# Altium schematic sheet CP2102.SchDoc
size A; SheetNumber: 5; SheetTotal: 7
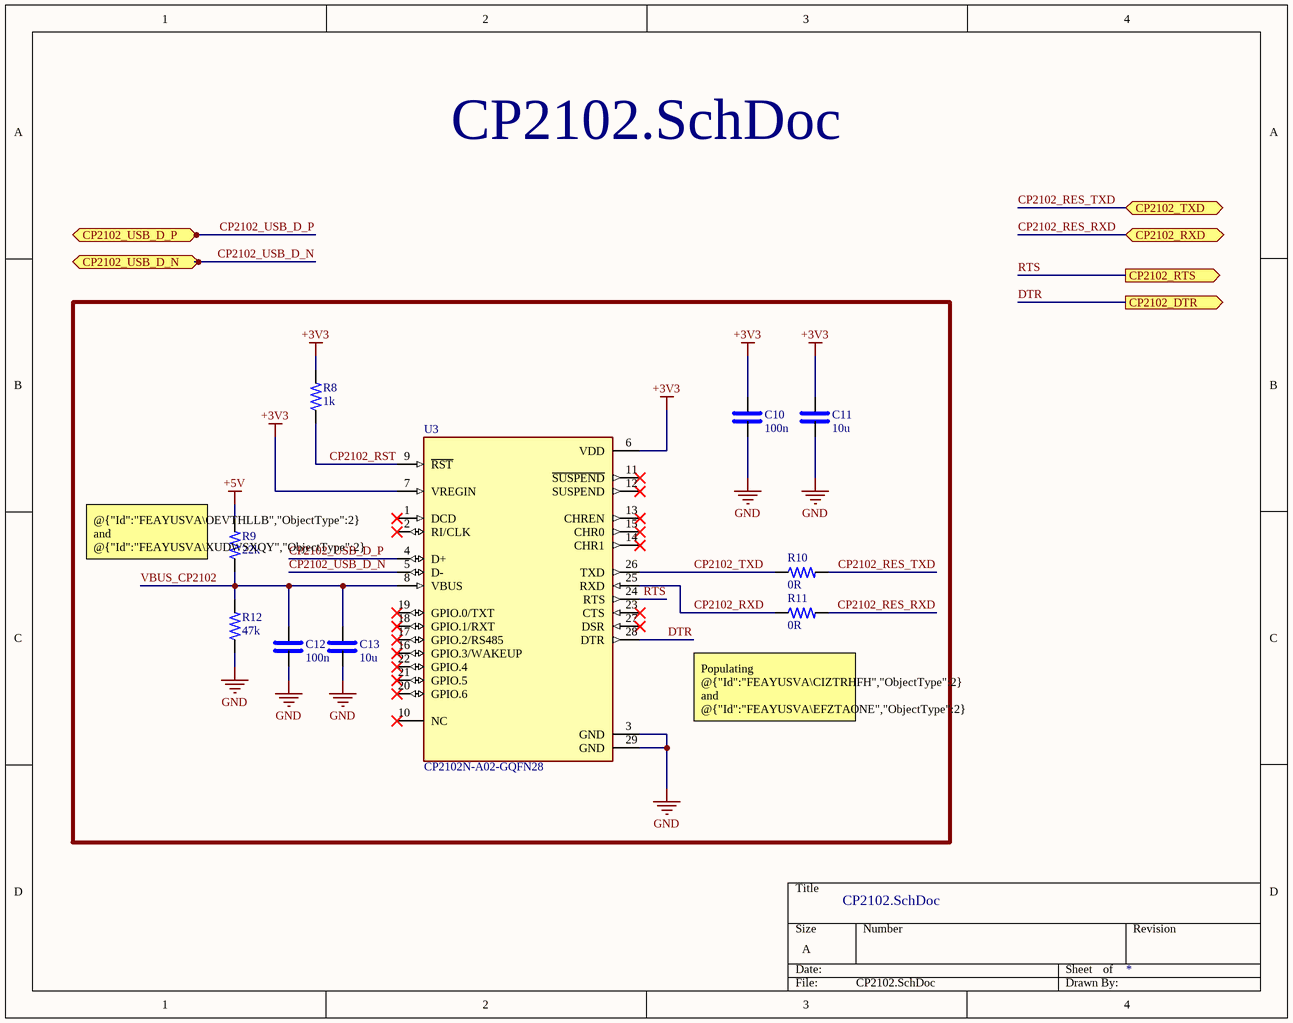
[diagram p0: CP2102.SchDoc]

## Parts
C10  100n  [0402 CAP]
C11  10u  [FP-GCJ188-0_2-IPC_C]
C12  100n  [0402 CAP]
C13  10u  [FP-GCJ188-0_2-IPC_C]
R8  1k  [0402 RES]
R9  22k  [0402 RES]
R10  0R  [0402 RES]
R11  0R  [0402 RES]
R12  47k  [0402 RES]
U3  CP2102N-A02-GQFN28  [QFN50P500X500X80-29N]

## Ports
CP2102_DTR (out, see Master[2C]), CP2102_RTS (out, see Master[2C]), CP2102_RXD (bidir, see Master[2C]), CP2102_TXD (bidir, see Master[2C]), CP2102_USB_D_N (bidir, see Master[3C]), CP2102_USB_D_P (bidir, see Master[3C])

## Nets
+3V3: C10.2 C11.2 R8.2 U3.6(VDD) U3.7(VREGIN)
+5V: R9.2
GND: C10.1 C11.1 C12.1 C13.1 R12.1 U3.3(GND) U3.29(GND)
CP2102_RES_RXD: R11.2 ; port CP2102_RXD
CP2102_RES_TXD: R10.2 ; port CP2102_TXD
CP2102_RST: R8.1 U3.9(~{RST})
CP2102_RXD: R11.1 U3.25(RXD)
CP2102_TXD: R10.1 U3.26(TXD)
CP2102_USB_D_N: U3.5(D-) ; port CP2102_USB_D_N
CP2102_USB_D_P: U3.4(D+) ; port CP2102_USB_D_P
DTR: U3.28(DTR) ; port CP2102_DTR
RTS: U3.24(RTS) ; port CP2102_RTS
VBUS_CP2102: C12.2 C13.2 R9.1 R12.2 U3.8(VBUS)

Not connected (* = marked no-connect by the designer): U3 1(DCD)* 2(RI/CLK)* 10(NC)* 11(~{SUSPEND})* 12(SUSPEND)* 13(CHREN)* 14(CHR1)* 15(CHR0)* 16(GPIO.3/WAKEUP)* 17(GPIO.2/RS485)* 18(GPIO.1/RXT)* 19(GPIO.0/TXT)* 20(GPIO.6)* 21(GPIO.5)* 22(GPIO.4)* 23(CTS)* 27(DSR)*

## Notes on the sheet
- (near R9) @{"Id":"FEAYUSVA\OEVTHLLB","ObjectType":2} and @{"Id":"FEAYUSVA\XUDWSXQY","ObjectType":2} are used to drop out the voltage to 3.3V
- (near R11) Populating @{"Id":"FEAYUSVA\CIZTRHFH","ObjectType":2} and @{"Id":"FEAYUSVA\EFZTAONE","ObjectType":2} is a must to program the ESP32 via UART.

## Library data of the parts
C10 C12 = 0402 SMD Capacitor: Multilayer Ceramic Capacitor, 0.1 uF, 25 V, ï¿½ 10%, X7R, 0402 [1005 Metric]; Manufacturer: Samsung; Manufacturer Part Number: CL05B104KA5NNNC; Material: 4241ConductorMaterial; Value: 100nF; Voltage Rating: 25V; ComponentLink1Description: Link; ComponentLink1URL: *; Supplier: Digikey; Supplier Part Number: 1276-6720-1-ND; RoHS: Yes; Category: Ceramic Capacitors; Stock: 9938397; Pricing: 1=0.08, 10=0.006, 50=0.0056, 100=0.0048, 500=0.0044, 1000=0.004, 2500=0.0032 (USD); Mounting Technology: Surface Mount; Case/Package: 0402; Case Code (Metric): 1005; Case Code (Imperial): 0402; Min Operating Temperature: -55°C; Max Operating Temperature: 125°C; Packaging: Cut Tape; Tolerance: 10%; Series: CL; Voltage Rating (DC): 25V; Length: 0.039inch; Width: 0.02inch; Height: 550um; Thickness: 0.022inch; RoHS Compliant: Yes; ComponentLink2URL: https://datasheet.octopart.com/CL05B104KA5NNNC-Samsung-Electro-Mechanics-datasheet-116890910.pdf?src-supplier=Future+Electronics; ComponentLink2Description: https://datasheet.octopart.com/CL05B104KA5NNNC-Samsung-Electro-Mechanics-datasheet-116890910.pdf?src-supplier=Future+Electronics; ComponentLink3URL: http://www.samsungsem.com/kr/support/product-search/mlcc/CL05B104KA5NNNC.jsp?src-supplier=Digikey; ComponentLink3Description: http://www.samsungsem.com/kr/support/product-search/mlcc/CL05B104KA5NNNC.jsp?src-supplier=Digikey
C11 C13 = 0603 SMD CAP: Multilayer Ceramic Capacitor, 10 uF, 25 V, ï¿½ 10%, X5R, 0603 [1608 Metric]; Manufacturer: Murata; Manufacturer Part Number: GRM188R61E106KA73D; Material: 4241ConductorMaterial; Dielectric: 1537DielectricType; Voltage Rating (DC): 25V; Supplier: Mouser; Supplier Part Number: 81-GRM188R61E106KA3D; RoHS: Yes; Category: Ceramic Capacitors; Stock: 343973; Pricing: 1=0.22, 10=0.073, 50=0.073, 100=0.054, 1000=0.05, 10000=0.038 (USD); Length: 1.6mm; Width: 800um; Height: 1mm; Thickness: 800um; ComponentLink1URL: https://datasheet.octopart.com/GRM188R61E106KA73D-Murata-datasheet-149523249.pdf?src-supplier=Newark; ComponentLink1Description: https://datasheet.octopart.com/GRM188R61E106KA73D-Murata-datasheet-149523249.pdf?src-supplier=Newark; ComponentLink2URL: https://search.murata.co.jp/Ceramy/image/img/A01X/G101/ENG/GRM188R61E106KA73-01.pdf?src-supplier=Digikey; ComponentLink2Description: https://search.murata.co.jp/Ceramy/image/img/A01X/G101/ENG/GRM188R61E106KA73-01.pdf?src-supplier=Digikey; ComponentLink3URL: https://datasheet.octopart.com/GRM188R61E106KA73D-Murata-datasheet-165579666.pdf?src-supplier=TME; ComponentLink3Description: https://datasheet.octopart.com/GRM188R61E106KA73D-Murata-datasheet-165579666.pdf?src-supplier=TME
R8 = 0402 SMD Resistor: Res Thick Film 0402 1K Ohm 1% 0.125W(1/8W) ±200ppm/C Pad SMD T/R; Manufacturer: Yageo; Manufacturer Part Number: RC0402FR-7W1KL; Value: 1kR; ComponentLink1Description: Link; ComponentLink1URL: *; Supplier: Digikey; Supplier Part Number: 13-RC0402FR-7W1KLCT-ND; RoHS: Yes; Category: Chip SMD Resistors; Stock: 22503; Pricing: 1=0.1, 10=0.013, 50=0.0108, 100=0.0082, 500=0.00714, 1000=0.00612, 5000=0.0051 (USD); Case/Package: 343Case; Packaging: 10Packaging; ComponentLink2URL: https://datasheet.octopart.com/RC0402FR-7W1KL-Yageo-datasheet-164759695.pdf?src-supplier=Newark; ComponentLink2Description: https://datasheet.octopart.com/RC0402FR-7W1KL-Yageo-datasheet-164759695.pdf?src-supplier=Newark
R9 = 0402 SMD Resistor: SMD Chip Resistor, 22 kOhm, ± 1%, 125 mW, 0402 [1005 Metric], Thick Film, General Purpose; Manufacturer: Yageo; Manufacturer Part Number: RC0402FR-7W1KL; Value: 1kR; Power Rating: 125mW; Temperature Coefficient: 100ppm/°C; Voltage Rating: 50V; ComponentLink1Description: Link; ComponentLink1URL: *; Supplier: Digikey; Supplier Part Number: 13-RC0402FR-7W1KLCT-ND; RoHS: Yes; Category: Chip SMD Resistors; Stock: 22503; Pricing: 1=0.1, 10=0.013, 50=0.0108, 100=0.0082, 500=0.00714, 1000=0.00612, 5000=0.0051 (USD); Case/Package: 343Case; Packaging: 10Packaging; ComponentLink2URL: https://datasheet.octopart.com/RC0402FR-7W1KL-Yageo-datasheet-164759695.pdf?src-supplier=Newark; ComponentLink2Description: https://datasheet.octopart.com/RC0402FR-7W1KL-Yageo-datasheet-164759695.pdf?src-supplier=Newark; Min Operating Temperature: -55°C; Max Operating Temperature: 155°C; Tolerance: 1%; Height: 370um; ComponentLink3URL: https://datasheet.octopart.com/AC0402FR-7W22KL-Yageo-datasheet-151884373.pdf?src-supplier=Future+Electronics; ComponentLink3Description: https://datasheet.octopart.com/AC0402FR-7W22KL-Yageo-datasheet-151884373.pdf?src-supplier=Future+Electronics
R10 R11 = 0402 SMD Resistor: SMD Chip Resistor, Jumper, 0 ohm, 100 mW, 0402 [1005 Metric], Thick Film, General Purpose; Manufacturer: Panasonic; Manufacturer Part Number: ERJ-2GE0R00X; Value: 0mR; Power Rating: 100mW; Voltage Rating: 50V; Temperature Coefficient: 600ppm/°C; ComponentLink1Description: Link; ComponentLink1URL: *; Supplier: Mouser; Supplier Part Number: 667-ERJ-2GE0R00X; RoHS: Yes; Category: Chip SMD Resistors; Stock: 616486; Pricing: 1=0.1, 10=0.013, 50=0.013, 100=0.008, 1000=0.006, 10000=0.004 (USD); Mounting Technology: Surface Mount; Case/Package: 0402; Pins: 2NUMBER; Contact Plating: Tin; Case Code (Metric): 1005; Case Code (Imperial): 0402; Min Operating Temperature: -55°C; Max Operating Temperature: 155°C; Resistor Type: Thick Film; Packaging: Cut Tape; Package Quantity: 10000; Number of Terminations: 2; Termination: SMD/SMT; Max Power Dissipation: 100mW; Features: Automotive AEC-Q200; Series: ERJ; Construction: Rectangular; Technology: THICK FILM; Voltage Rating (DC): 50V; Length: 1mm; Width: 0.5mm; Height: 0.35mm; Depth: 0.5mm; Ratings: AEC-Q200; Radiation Hardening: No; Reach SVHC Compliant: No; Military Standard: Not; RoHS Compliant: Yes; Lead Free: 5697LeadFree; ComponentLink2URL: https://datasheet.ciiva.com/11821/0900766b80f806dd-11821176.pdf?src-supplier=Rs; ComponentLink2Description: https://datasheet.ciiva.com/11821/0900766b80f806dd-11821176.pdf?src-supplier=Rs; ComponentLink3URL: https://datasheet.ciiva.com/46389/1678796-46389518.pdf?src-supplier=Element14; ComponentLink3Description: https://datasheet.ciiva.com/46389/1678796-46389518.pdf?src-supplier=Element14; ComponentLink4URL: https://datasheet.ciiva.com/28695/1678796-28695758.pdf?src-supplier=Element14; ComponentLink4Description: https://datasheet.ciiva.com/28695/1678796-28695758.pdf?src-supplier=Element14; ComponentLink5URL: https://datasheet.ciiva.com/16778/70260739-16778335.pdf?src-supplier=Allied+Electronics; ComponentLink5Description: https://datasheet.ciiva.com/16778/70260739-16778335.pdf?src-supplier=Allied+Electronics; ComponentLink6URL: https://datasheet.ciiva.com/48531/aoa0000ce1-48531077.pdf?src-supplier=Avnet; ComponentLink6Description: https://datasheet.ciiva.com/48531/aoa0000ce1-48531077.pdf?src-supplier=Avnet; ComponentLink7URL: https://datasheet.ciiva.com/30097/4aoa0000ce1-30097116.pdf?src-supplier=Onlinecomponents.com; ComponentLink7Description: https://datasheet.ciiva.com/30097/4aoa0000ce1-30097116.pdf?src-supplier=Onlinecomponents.com; ComponentLink8URL: https://datasheet.ciiva.com/43460/1678796-43460347.pdf?src-supplier=Farnell; ComponentLink8Description: https://datasheet.ciiva.com/43460/1678796-43460347.pdf?src-supplier=Farnell; ComponentLink9URL: https://datasheet.ciiva.com/5959/1678796-5959692.pdf?src-supplier=Farnell; ComponentLink9Description: https://datasheet.ciiva.com/5959/1678796-5959692.pdf?src-supplier=Farnell; ComponentLink10URL: https://datasheet.ciiva.com/16783/70260739-16783734.pdf?src-supplier=Allied+Electronics; ComponentLink10Description: https://datasheet.ciiva.com/16783/70260739-16783734.pdf?src-supplier=Allied+Electronics
R12 = 0402 SMD Resistor: Res, 47K, 1%, 0.125W, Thick Film, 0402 Rohs Compliant: Yes |Vishay RCC040247K0FKED; Manufacturer: Yageo; Manufacturer Part Number: RC0402FR-7W1KL; Value: 1kR; Power Rating: 125mW; Temperature Coefficient: 100ppm/°C; Voltage Rating: 75V; ComponentLink1Description: Link; ComponentLink1URL: *; Supplier: Digikey; Supplier Part Number: 13-RC0402FR-7W1KLCT-ND; RoHS: Yes; Category: Chip SMD Resistors; Stock: 22503; Pricing: 1=0.1, 10=0.013, 50=0.0108, 100=0.0082, 500=0.00714, 1000=0.00612, 5000=0.0051 (USD); Case/Package: 343Case; Packaging: 10Packaging; ComponentLink2URL: https://datasheet.octopart.com/RC0402FR-7W1KL-Yageo-datasheet-164759695.pdf?src-supplier=Newark; ComponentLink2Description: https://datasheet.octopart.com/RC0402FR-7W1KL-Yageo-datasheet-164759695.pdf?src-supplier=Newark; Min Operating Temperature: -55°C; Max Operating Temperature: 155°C; Tolerance: 1%; Height: 400um; RoHS Compliant: Yes
U3 = CP2102N-A02-GQFN28: USB Bridge, USB to UART USB 2.0 UART Interface 28-QFN (5x5); MF: Silicon Labs; Value: *; Price: None; Package: WFQFN-28 Silicon Labs; Check_prices: https://www.snapeda.com/parts/CP2102N-A02-GQFN28/Silicon+Labs/view-part/?ref=eda; Availability: In Stock; SnapEDA_Link: https://www.snapeda.com/parts/CP2102N-A02-GQFN28/Silicon+Labs/view-part/?ref=snap; Purchase-URL: https://pricing.snapeda.com/search/part/CP2102N-A02-GQFN28/?ref=eda; MP: CP2102N-A02-GQFN28